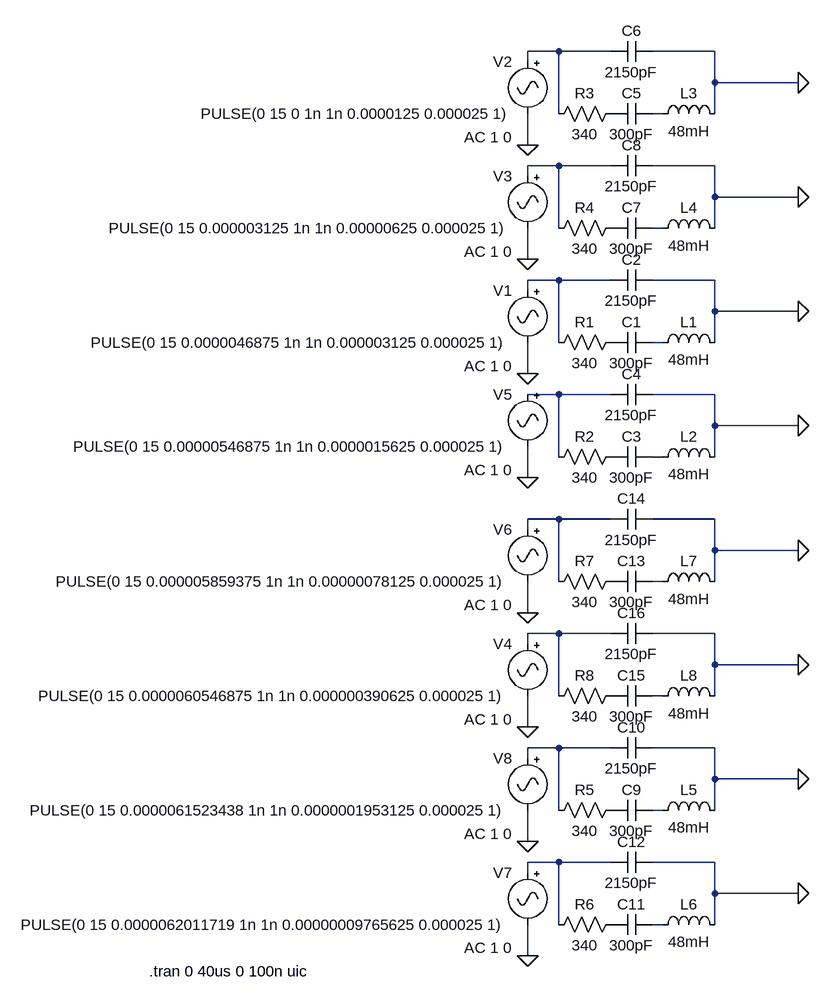
[diagram p0: schematic PWM-attenuation.asc]
PWM-attenuation.asc, the LTspice schematic file:
Version 4
SHEET 1 984 1176
WIRE 80 -256 32 -256
WIRE 160 -256 80 -256
WIRE 320 -256 224 -256
WIRE 32 -240 32 -256
WIRE 320 -208 320 -256
WIRE 448 -208 320 -208
WIRE 80 -160 80 -256
WIRE 240 -160 224 -160
WIRE 320 -160 320 -208
WIRE 32 -112 32 -160
WIRE 80 -80 32 -80
WIRE 160 -80 80 -80
WIRE 320 -80 224 -80
WIRE 32 -64 32 -80
WIRE 320 -32 320 -80
WIRE 448 -32 320 -32
WIRE 80 16 80 -80
WIRE 240 16 224 16
WIRE 320 16 320 -32
WIRE 32 64 32 16
WIRE 80 96 32 96
WIRE 160 96 80 96
WIRE 320 96 224 96
WIRE 32 112 32 96
WIRE 320 144 320 96
WIRE 448 144 320 144
WIRE 80 192 80 96
WIRE 240 192 224 192
WIRE 320 192 320 144
WIRE 32 240 32 192
WIRE 80 272 32 272
WIRE 160 272 80 272
WIRE 320 272 224 272
WIRE 320 320 320 272
WIRE 448 320 320 320
WIRE 80 368 80 272
WIRE 240 368 224 368
WIRE 320 368 320 320
WIRE 32 400 32 352
WIRE 80 464 32 464
WIRE 160 464 80 464
WIRE 320 464 224 464
WIRE 32 480 32 464
WIRE 320 512 320 464
WIRE 448 512 320 512
WIRE 80 560 80 464
WIRE 240 560 224 560
WIRE 320 560 320 512
WIRE 32 608 32 560
WIRE 80 640 32 640
WIRE 160 640 80 640
WIRE 320 640 224 640
WIRE 32 656 32 640
WIRE 320 688 320 640
WIRE 448 688 320 688
WIRE 80 736 80 640
WIRE 240 736 224 736
WIRE 320 736 320 688
WIRE 32 784 32 736
WIRE 80 816 32 816
WIRE 160 816 80 816
WIRE 320 816 224 816
WIRE 32 832 32 816
WIRE 320 864 320 816
WIRE 448 864 320 864
WIRE 80 912 80 816
WIRE 240 912 224 912
WIRE 320 912 320 864
WIRE 32 960 32 912
WIRE 80 992 32 992
WIRE 160 992 80 992
WIRE 320 992 224 992
WIRE 32 1008 32 992
WIRE 320 1040 320 992
WIRE 448 1040 320 1040
WIRE 80 1088 80 992
WIRE 240 1088 224 1088
WIRE 320 1088 320 1040
WIRE 32 1136 32 1088
FLAG 32 240 0
FLAG 448 144 0
FLAG 448 320 0
FLAG 448 -208 0
FLAG 448 -32 0
FLAG 448 864 0
FLAG 448 1040 0
FLAG 448 512 0
FLAG 448 688 0
FLAG 32 -112 0
FLAG 32 64 0
FLAG 32 784 0
FLAG 32 400 0
FLAG 32 608 0
FLAG 32 1136 0
FLAG 32 960 0
SYMBOL cap 160 176 M90
WINDOW 0 0 32 VBottom 2
WINDOW 3 32 32 VTop 2
SYMATTR InstName C1
SYMATTR Value 300pF
SYMBOL cap 160 112 R270
WINDOW 0 32 32 VTop 2
WINDOW 3 0 32 VBottom 2
SYMATTR InstName C2
SYMATTR Value 2150pF
SYMBOL res 64 208 R270
WINDOW 0 32 56 VTop 2
WINDOW 3 0 56 VBottom 2
SYMATTR InstName R1
SYMATTR Value 340
SYMBOL ind 224 208 R270
WINDOW 0 32 56 VTop 2
WINDOW 3 5 56 VBottom 2
SYMATTR InstName L1
SYMATTR Value 48mH
SYMBOL Misc\\signal 32 96 M0
WINDOW 123 24 132 Left 2
WINDOW 39 0 0 Left 2
SYMATTR Value2 AC 1 0
SYMATTR InstName V1
SYMATTR Value PULSE(0 15 0.0000046875 1n 1n 0.000003125 0.000025 1)
SYMBOL cap 160 352 M90
WINDOW 0 0 32 VBottom 2
WINDOW 3 32 32 VTop 2
SYMATTR InstName C3
SYMATTR Value 300pF
SYMBOL cap 160 288 R270
WINDOW 0 32 32 VTop 2
WINDOW 3 0 32 VBottom 2
SYMATTR InstName C4
SYMATTR Value 2150pF
SYMBOL res 64 384 R270
WINDOW 0 32 56 VTop 2
WINDOW 3 0 56 VBottom 2
SYMATTR InstName R2
SYMATTR Value 340
SYMBOL ind 224 384 R270
WINDOW 0 32 56 VTop 2
WINDOW 3 5 56 VBottom 2
SYMATTR InstName L2
SYMATTR Value 48mH
SYMBOL cap 160 -176 M90
WINDOW 0 0 32 VBottom 2
WINDOW 3 32 32 VTop 2
SYMATTR InstName C5
SYMATTR Value 300pF
SYMBOL cap 160 -240 R270
WINDOW 0 32 32 VTop 2
WINDOW 3 0 32 VBottom 2
SYMATTR InstName C6
SYMATTR Value 2150pF
SYMBOL res 64 -144 R270
WINDOW 0 32 56 VTop 2
WINDOW 3 0 56 VBottom 2
SYMATTR InstName R3
SYMATTR Value 340
SYMBOL ind 224 -144 R270
WINDOW 0 32 56 VTop 2
WINDOW 3 5 56 VBottom 2
SYMATTR InstName L3
SYMATTR Value 48mH
SYMBOL cap 160 0 M90
WINDOW 0 0 32 VBottom 2
WINDOW 3 32 32 VTop 2
SYMATTR InstName C7
SYMATTR Value 300pF
SYMBOL cap 160 -64 R270
WINDOW 0 32 32 VTop 2
WINDOW 3 0 32 VBottom 2
SYMATTR InstName C8
SYMATTR Value 2150pF
SYMBOL res 64 32 R270
WINDOW 0 32 56 VTop 2
WINDOW 3 0 56 VBottom 2
SYMATTR InstName R4
SYMATTR Value 340
SYMBOL ind 224 32 R270
WINDOW 0 32 56 VTop 2
WINDOW 3 5 56 VBottom 2
SYMATTR InstName L4
SYMATTR Value 48mH
SYMBOL cap 160 896 M90
WINDOW 0 0 32 VBottom 2
WINDOW 3 32 32 VTop 2
SYMATTR InstName C9
SYMATTR Value 300pF
SYMBOL cap 160 832 R270
WINDOW 0 32 32 VTop 2
WINDOW 3 0 32 VBottom 2
SYMATTR InstName C10
SYMATTR Value 2150pF
SYMBOL res 64 928 R270
WINDOW 0 32 56 VTop 2
WINDOW 3 0 56 VBottom 2
SYMATTR InstName R5
SYMATTR Value 340
SYMBOL ind 224 928 R270
WINDOW 0 32 56 VTop 2
WINDOW 3 5 56 VBottom 2
SYMATTR InstName L5
SYMATTR Value 48mH
SYMBOL cap 160 1072 M90
WINDOW 0 0 32 VBottom 2
WINDOW 3 32 32 VTop 2
SYMATTR InstName C11
SYMATTR Value 300pF
SYMBOL cap 160 1008 R270
WINDOW 0 32 32 VTop 2
WINDOW 3 0 32 VBottom 2
SYMATTR InstName C12
SYMATTR Value 2150pF
SYMBOL res 64 1104 R270
WINDOW 0 32 56 VTop 2
WINDOW 3 0 56 VBottom 2
SYMATTR InstName R6
SYMATTR Value 340
SYMBOL ind 224 1104 R270
WINDOW 0 32 56 VTop 2
WINDOW 3 5 56 VBottom 2
SYMATTR InstName L6
SYMATTR Value 48mH
SYMBOL cap 160 544 M90
WINDOW 0 0 32 VBottom 2
WINDOW 3 32 32 VTop 2
SYMATTR InstName C13
SYMATTR Value 300pF
SYMBOL cap 160 480 R270
WINDOW 0 32 32 VTop 2
WINDOW 3 0 32 VBottom 2
SYMATTR InstName C14
SYMATTR Value 2150pF
SYMBOL res 64 576 R270
WINDOW 0 32 56 VTop 2
WINDOW 3 0 56 VBottom 2
SYMATTR InstName R7
SYMATTR Value 340
SYMBOL ind 224 576 R270
WINDOW 0 32 56 VTop 2
WINDOW 3 5 56 VBottom 2
SYMATTR InstName L7
SYMATTR Value 48mH
SYMBOL cap 160 720 M90
WINDOW 0 0 32 VBottom 2
WINDOW 3 32 32 VTop 2
SYMATTR InstName C15
SYMATTR Value 300pF
SYMBOL cap 160 656 R270
WINDOW 0 32 32 VTop 2
WINDOW 3 0 32 VBottom 2
SYMATTR InstName C16
SYMATTR Value 2150pF
SYMBOL res 64 752 R270
WINDOW 0 32 56 VTop 2
WINDOW 3 0 56 VBottom 2
SYMATTR InstName R8
SYMATTR Value 340
SYMBOL ind 224 752 R270
WINDOW 0 32 56 VTop 2
WINDOW 3 5 56 VBottom 2
SYMATTR InstName L8
SYMATTR Value 48mH
SYMBOL Misc\\signal 32 -256 M0
WINDOW 123 24 132 Left 2
WINDOW 39 0 0 Left 2
SYMATTR Value2 AC 1 0
SYMATTR InstName V2
SYMATTR Value PULSE(0 15 0 1n 1n 0.0000125 0.000025 1)
SYMBOL Misc\\signal 32 -80 M0
WINDOW 123 24 132 Left 2
WINDOW 39 0 0 Left 2
SYMATTR Value2 AC 1 0
SYMATTR InstName V3
SYMATTR Value PULSE(0 15 0.000003125 1n 1n 0.00000625 0.000025 1)
SYMBOL Misc\\signal 32 640 M0
WINDOW 123 24 132 Left 2
WINDOW 39 0 0 Left 2
SYMATTR Value2 AC 1 0
SYMATTR InstName V4
SYMATTR Value PULSE(0 15 0.0000060546875 1n 1n 0.000000390625 0.000025 1)
SYMBOL Misc\\signal 32 256 M0
WINDOW 123 24 132 Left 2
WINDOW 39 0 0 Left 2
SYMATTR Value2 AC 1 0
SYMATTR InstName V5
SYMATTR Value PULSE(0 15 0.00000546875 1n 1n 0.0000015625 0.000025 1)
SYMBOL Misc\\signal 32 464 M0
WINDOW 123 24 132 Left 2
WINDOW 39 0 0 Left 2
SYMATTR Value2 AC 1 0
SYMATTR InstName V6
SYMATTR Value PULSE(0 15 0.000005859375 1n 1n 0.00000078125 0.000025 1)
SYMBOL Misc\\signal 32 992 M0
WINDOW 123 24 132 Left 2
WINDOW 39 0 0 Left 2
SYMATTR Value2 AC 1 0
SYMATTR InstName V7
SYMATTR Value PULSE(0 15 0.0000062011719 1n 1n 0.00000009765625 0.000025 1)
SYMBOL Misc\\signal 32 816 M0
WINDOW 123 24 132 Left 2
WINDOW 39 0 0 Left 2
SYMATTR Value2 AC 1 0
SYMATTR InstName V8
SYMATTR Value PULSE(0 15 0.0000061523438 1n 1n 0.0000001953125 0.000025 1)
TEXT -550 1160 Left 2 !.tran 0 40us 0 100n uic

The netlist it stands for:
* PWM-attenuation.asc
C1 P001 N006 300pF
C2 N005 0 2150pF
R1 N005 P001 340
L1 N006 0 48mH
V1 N005 0 PULSE(0 15 0.0000046875 1n 1n 0.000003125 0.000025 1) AC 1 0
C3 P002 N008 300pF
C4 N007 0 2150pF
R2 N007 P002 340
L2 N008 0 48mH
C5 P003 N002 300pF
C6 N001 0 2150pF
R3 N001 P003 340
L3 N002 0 48mH
C7 P004 N004 300pF
C8 N003 0 2150pF
R4 N003 P004 340
L4 N004 0 48mH
C9 P005 N014 300pF
C10 N013 0 2150pF
R5 N013 P005 340
L5 N014 0 48mH
C11 P006 N016 300pF
C12 N015 0 2150pF
R6 N015 P006 340
L6 N016 0 48mH
C13 P007 N010 300pF
C14 N009 0 2150pF
R7 N009 P007 340
L7 N010 0 48mH
C15 P008 N012 300pF
C16 N011 0 2150pF
R8 N011 P008 340
L8 N012 0 48mH
V2 N001 0 PULSE(0 15 0 1n 1n 0.0000125 0.000025 1) AC 1 0
V3 N003 0 PULSE(0 15 0.000003125 1n 1n 0.00000625 0.000025 1) AC 1 0
V4 N011 0 PULSE(0 15 0.0000060546875 1n 1n 0.000000390625 0.000025 1) AC 1 0
V5 N007 0 PULSE(0 15 0.00000546875 1n 1n 0.0000015625 0.000025 1) AC 1 0
V6 N009 0 PULSE(0 15 0.000005859375 1n 1n 0.00000078125 0.000025 1) AC 1 0
V7 N015 0 PULSE(0 15 0.0000062011719 1n 1n 0.00000009765625 0.000025 1) AC 1 0
V8 N013 0 PULSE(0 15 0.0000061523438 1n 1n 0.0000001953125 0.000025 1) AC 1 0
.tran 0 40us 0 100n uic
.backanno
.end